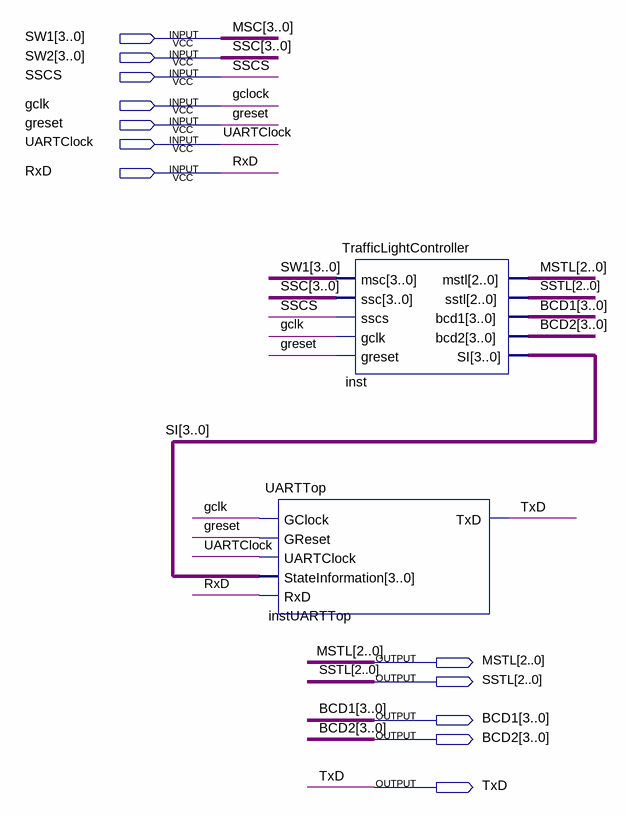
[diagram p0: schematic sheet]
// Quartus schematic TrafficLightControllerWithDebugMessages.bdf as structural Verilog: 2 symbols, 12 pins
module TrafficLightControllerWithDebugMessages (
  input  [3:0] SW1,
  input  [3:0] SW2,
  input  SSCS,
  input  gclk,
  input  greset,
  input  UARTClock,
  input  RxD,
  output [2:0] MSTL,
  output [2:0] SSTL,
  output [3:0] BCD1,
  output [3:0] BCD2,
  output TxD
);

  wire [3:0] SI;

  UARTTop instUARTTop (
    .GClock(gclk), .GReset(greset), .UARTClock(UARTClock), .StateInformation(SI), .RxD(RxD), .TxD(TxD));
  TrafficLightController inst (
    .msc(SW1), .ssc(SW2), .sscs(SSCS), .gclk(gclk), .greset(greset), .mstl(MSTL), .sstl(SSTL), .bcd1(BCD1),
    .bcd2(BCD2), .SI(SI));

  // Other names for the same wires on the sheet: gclock = gclk; MSC[3:0] = SW1; SSC[3:0] = SW2
endmodule
